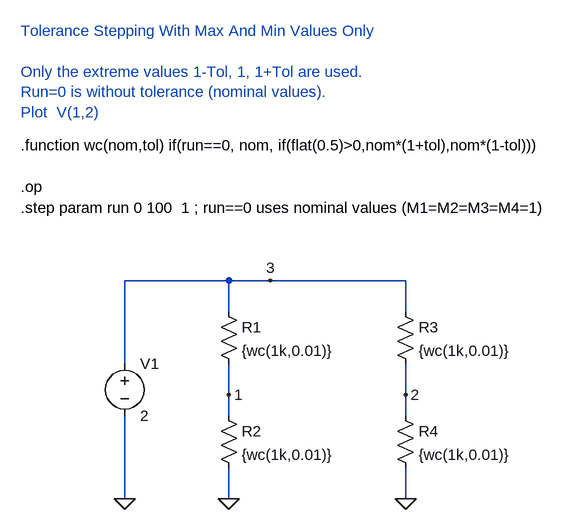
[diagram p0: schematic Tolerance_Stepping_min_max_flat.asc]
Tolerance_Stepping_min_max_flat.asc, the LTspice schematic file:
Version 4
SHEET 1 1432 788
WIRE 224 384 64 384
WIRE 288 384 224 384
WIRE 496 384 288 384
WIRE 224 432 224 384
WIRE 496 432 496 384
WIRE 64 512 64 384
WIRE 224 560 224 512
WIRE 496 560 496 512
WIRE 224 592 224 560
WIRE 496 592 496 560
WIRE 64 720 64 592
WIRE 224 720 224 672
WIRE 496 720 496 672
FLAG 64 720 0
FLAG 224 720 0
FLAG 496 720 0
FLAG 224 560 1
FLAG 496 560 2
FLAG 288 384 3
SYMBOL res 208 416 R0
SYMATTR InstName R1
SYMATTR Value {wc(1k,0.01)}
SYMBOL res 208 576 R0
SYMATTR InstName R2
SYMATTR Value {wc(1k,0.01)}
SYMBOL voltage 64 496 R0
SYMATTR InstName V1
SYMATTR Value 2
SYMBOL res 480 416 R0
SYMATTR InstName R3
SYMATTR Value {wc(1k,0.01)}
SYMBOL res 480 576 R0
SYMATTR InstName R4
SYMATTR Value {wc(1k,0.01)}
TEXT -96 240 Left 0 !.op
TEXT -96 272 Left 0 !.step param run 0 100  1 ; run==0 uses nominal values (M1=M2=M3=M4=1)
TEXT -96 0 Left 0 ;Tolerance Stepping With Max And Min Values Only\n \nOnly the extreme values 1-Tol, 1, 1+Tol are used.\nRun=0 is without tolerance (nominal values).\nPlot  V(1,2)
TEXT -96 176 Left 0 !.function wc(nom,tol) if(run==0, nom, if(flat(0.5)>0,nom*(1+tol),nom*(1-tol)))

The netlist it stands for:
* Tolerance_Stepping_min_max_flat.asc
R1 3 1 {wc(1k,0.01)}
R2 1 0 {wc(1k,0.01)}
V1 3 0 2
R3 3 2 {wc(1k,0.01)}
R4 2 0 {wc(1k,0.01)}
.op
.step param run 0 100  1 ; run==0 uses nominal values (M1=M2=M3=M4=1)
* Tolerance Stepping With Max And Min Values Only
* Only the extreme values 1-Tol, 1, 1+Tol are used.
* Run=0 is without tolerance (nominal values).
* Plot  V(1,2)
.function wc(nom,tol) if(run==0, nom, if(flat(0.5)>0,nom*(1+tol),nom*(1-tol)))
.backanno
.end